# Altium schematic sheet Microcontroller.SchDoc
size 558 x 431 mm; SheetNumber: 2; SheetTotal: 4
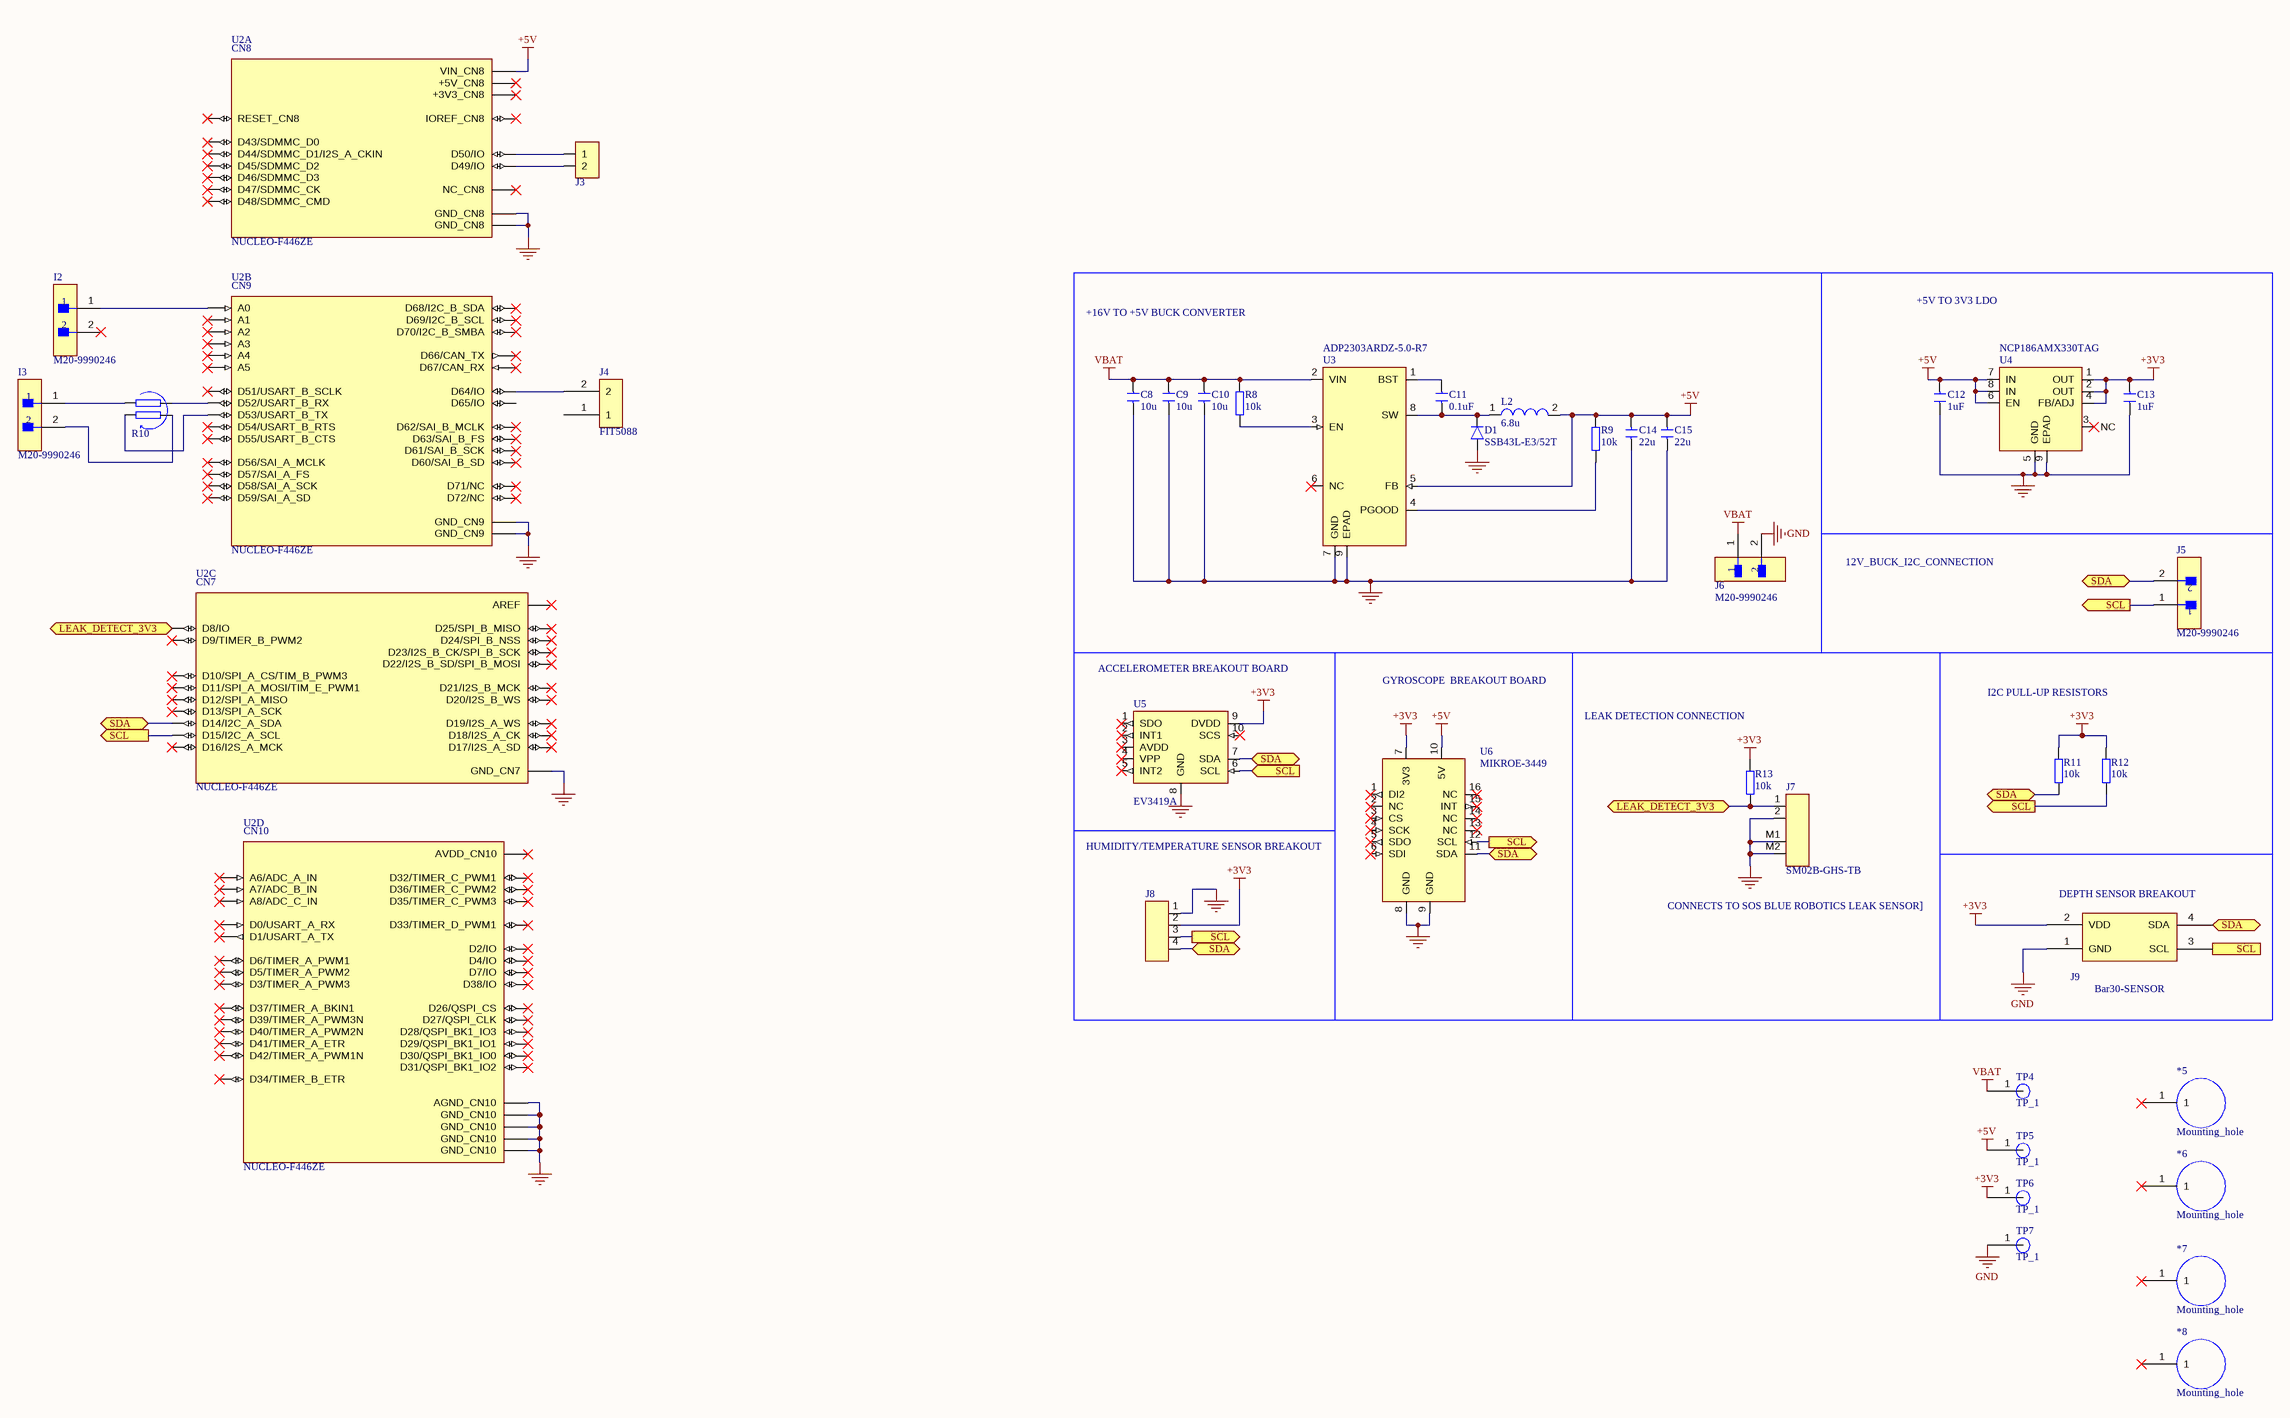
[diagram p0: Microcontroller.SchDoc]

## Parts
*5  Mounting_hole  [Mounting_Hole]
*6  Mounting_hole  [Mounting_Hole]
*7  Mounting_hole  [Mounting_Hole]
*8  Mounting_hole  [Mounting_Hole]
C8  10u  [1206 Capacitor]
C9  10u  [1206 Capacitor]
C10  10u  [1206 Capacitor]
C11  0.1uF  [0603 Capacitor]
C12  1uF  [0603 Capacitor]
C13  1uF  [0603 Capacitor]
C14  22u  [0805 Capacitor]
C15  22u  [0805 Capacitor]
D1  SSB43L-E3/52T  [DO-214AA]
I2  M20-9990246  [FP-M20-9990246-MFG]
I3  M20-9990246  [FP-M20-9990246-MFG]
J3  PREC002SAAN-RC  [Header 2.54mm]  (value not drawn)
J4  FIT5088  [FIT0588]
J5  M20-9990246  [FP-M20-9990246-MFG]
J6  M20-9990246  [FP-M20-9990246-MFG]
J7  SM02B-GHS-TB  [SM02B-GHS-TB]
J8  PPTC041LFBN-RC  [HDR 4POS 2.54mm]  (value not drawn)
J9  Bar30-SENSOR  [Bar30 Depth Sensor]
L2  6.8u  [CLF10060NIT-6R8N-D 10.10mm x 10.00mm]
R8  10k  [0603 Resistor]
R9  10k  [0603 Resistor]
R10  Resistor Signal Switch  [Resistor Signal Switch-Footprint]  (value not drawn)
R11  10k  [0603 Resistor]
R12  10k  [0603 Resistor]
R13  10k  [0603 Resistor]
TP4  TP_1  [Test_point1]  (no BOM)
TP5  TP_1  [Test_point1]  (no BOM)
TP6  TP_1  [Test_point1]  (no BOM)
TP7  TP_1  [Test_point1]  (no BOM)
U2  NUCLEO-F446ZE  [MODULE_NUCLEO-F446ZE]  (parts A,B,C,D of 4)
U3  ADP2303ARDZ-5.0-R7  [SOIC-8-EP]
U4  NCP186AMX330TAG  [8-XFDFN Exposed Pad]
U5  EV3419A  [EV3419A]
U6  MIKROE-3449  [MIKROE-3449]

## Ports
LEAK_DETECT_3V3 (bidir, see Microcontroller[3E]), LEAK_DETECT_3V3 (bidir, see Microcontroller[9E]), SCL (in, see Microcontroller[1D], Microcontroller[2E], Microcontroller[4D], Microcontroller[5D], Microcontroller[9E]), SCL (out, see Microcontroller[1D], Microcontroller[2E], Microcontroller[4D], Microcontroller[5D], Microcontroller[5E]), SCL (out, see Microcontroller[1D], Microcontroller[2E], Microcontroller[4D], Microcontroller[5D], Microcontroller[5E], Microcontroller[9E]), SCL (out, see Microcontroller[1D], Microcontroller[2E], Microcontroller[4D], Microcontroller[5E], Microcontroller[9E]), SCL (out, see Microcontroller[1D], Microcontroller[2E], Microcontroller[5D], Microcontroller[5E], Microcontroller[9E]), SCL (out, see Microcontroller[2E], Microcontroller[4D], Microcontroller[5D], Microcontroller[5E], Microcontroller[9E]), SDA (bidir, see Microcontroller[1D], Microcontroller[2E], Microcontroller[4D], Microcontroller[5D], Microcontroller[5E]), SDA (bidir, see Microcontroller[1D], Microcontroller[2E], Microcontroller[4D], Microcontroller[5D], Microcontroller[5E], Microcontroller[9E]), SDA (bidir, see Microcontroller[1D], Microcontroller[2E], Microcontroller[4D], Microcontroller[5D], Microcontroller[9E]), SDA (bidir, see Microcontroller[1D], Microcontroller[2E], Microcontroller[4D], Microcontroller[5E], Microcontroller[9E]), SDA (bidir, see Microcontroller[1D], Microcontroller[2E], Microcontroller[5D], Microcontroller[5E], Microcontroller[9E]), SDA (bidir, see Microcontroller[2E], Microcontroller[4D], Microcontroller[5D], Microcontroller[5E], Microcontroller[9E])

## Nets
+3V3: C13.1 J8.2 J9.2(VDD) R11.2 R12.2 R13.2 TP6.1 U4.1(OUT) U4.2(OUT) U4.4(FB/ADJ) U5.9(DVDD) U6.7(3V3)
+5V: C12.1 C14.1 C15.1 L2.2 R9.1 TP5.1 U2.CN8_15(VIN_CN8) U3.5(FB) U4.6(EN) U4.7(IN) U4.8(IN) U6.10(5V)
GND: C8.1 C9.1 C10.1 C12.2 C13.2 C14.2 C15.2 D1.A J6.2 J7.2 J7.M1 J7.M2 J8.1 J9.1(GND) TP7.1 U2.CN7_8(GND_CN7) U2.CN8_11(GND_CN8) U2.CN8_13(GND_CN8) U2.CN9_12(GND_CN9) U2.CN9_23(GND_CN9) U2.CN10_3(AGND_CN10) U2.CN10_5(GND_CN10) U2.CN10_17(GND_CN10) U2.CN10_22(GND_CN10) U2.CN10_27(GND_CN10) U3.7(GND) U3.9(EPAD) U4.5(GND) U4.9(EPAD) U5.8(GND) U6.8(GND) U6.9(GND)
VBAT: C8.2 C9.2 C10.2 J6.1 R8.1 TP4.1 U3.2(VIN)
LEAK_DETECT_3V3: J7.1 R13.1 U2.CN7_20(D8/IO) ; port LEAK_DETECT_3V3
SCL: J5.1 J8.3 J9.3(SCL) R12.1 U2.CN7_2(D15/I2C_A_SCL) U5.6(SCL) U6.12(SCL) ; port SCL
SDA: J5.2 J8.4 J9.4(SDA) R11.1 U2.CN7_4(D14/I2C_A_SDA) U5.7(SDA) U6.11(SDA) ; port SDA
NetC11_1: C11.1 D1.C L2.1 U3.8(SW)
NetC11_2: C11.2 U3.1(BST)
NetI2_1: I2.1 U2.CN9_1(A0)
NetI3_1: I3.1 R10.4
NetI3_2: I3.2 R10.1
NetJ3_1: J3.1 U2.CN8_16(D50/IO)
NetJ3_2: J3.2 U2.CN8_14(D49/IO)
NetJ4_2: J4.2 U2.CN9_30(D64/IO)
NetR8_2: R8.2 U3.3(EN)
NetR9_2: R9.2 U3.4(PGOOD)
NetR10_2: R10.2 U2.CN9_6(D53/USART_B_TX)
NetR10_3: R10.3 U2.CN9_4(D52/USART_B_RX)

Not connected (* = marked no-connect by the designer): *5 1*; *6 1*; *7 1*; *8 1*; I2 2*; J4 1; U2 CN7_1(D16/I2S_A_MCK)* CN7_3(D17/I2S_A_SD)* CN7_5(D18/I2S_A_CK)* CN7_6(AREF)* CN7_7(D19/I2S_A_WS)* CN7_9(D20/I2S_B_WS)* CN7_10(D13/SPI_A_SCK)* CN7_11(D21/I2S_B_MCK)* CN7_12(D12/SPI_A_MISO)* CN7_13(D22/I2S_B_SD/SPI_B_MOSI)* CN7_14(D11/SPI_A_MOSI/TIM_E_PWM1)* CN7_15(D23/I2S_B_CK/SPI_B_SCK)* CN7_16(D10/SPI_A_CS/TIM_B_PWM3)* CN7_17(D24/SPI_B_NSS)* CN7_18(D9/TIMER_B_PWM2)* CN7_19(D25/SPI_B_MISO)* CN8_1(NC_CN8)* CN8_2(D43/SDMMC_D0)* CN8_3(IOREF_CN8)* CN8_4(D44/SDMMC_D1/I2S_A_CKIN)* CN8_5(RESET_CN8)* CN8_6(D45/SDMMC_D2)* CN8_7(+3V3_CN8)* CN8_8(D46/SDMMC_D3)* CN8_9(+5V_CN8)* CN8_10(D47/SDMMC_CK)* CN8_12(D48/SDMMC_CMD)* CN9_2(D51/USART_B_SCLK)* CN9_3(A1)* CN9_5(A2)* CN9_7(A3)* CN9_8(D54/USART_B_RTS)* CN9_9(A4)* CN9_10(D55/USART_B_CTS)* CN9_11(A5)* CN9_13(D72/NC)* CN9_14(D56/SAI_A_MCLK)* CN9_15(D71/NC)* CN9_16(D57/SAI_A_FS)* CN9_17(D70/I2C_B_SMBA)* CN9_18(D58/SAI_A_SCK)* CN9_19(D69/I2C_B_SCL)* CN9_20(D59/SAI_A_SD)* CN9_21(D68/I2C_B_SDA)* CN9_22(D60/SAI_B_SD)* CN9_24(D61/SAI_B_SCK)* CN9_25(D67/CAN_RX)* CN9_26(D62/SAI_B_MCLK)* CN9_27(D66/CAN_TX)* CN9_28(D63/SAI_B_FS)* CN9_29(D65/IO) CN10_1(AVDD_CN10)* CN10_2(D7/IO)* CN10_4(D6/TIMER_A_PWM1)* CN10_6(D5/TIMER_A_PWM2)* CN10_7(A6/ADC_A_IN)* CN10_8(D4/IO)* CN10_9(A7/ADC_B_IN)* CN10_10(D3/TIMER_A_PWM3)* CN10_11(A8/ADC_C_IN)* CN10_12(D2/IO)* CN10_13(D26/QSPI_CS)* CN10_14(D1/USART_A_TX)* CN10_15(D27/QSPI_CLK)* CN10_16(D0/USART_A_RX)* CN10_18(D42/TIMER_A_PWM1N)* CN10_19(D28/QSPI_BK1_IO3)* CN10_20(D41/TIMER_A_ETR)* CN10_21(D29/QSPI_BK1_IO1)* CN10_23(D30/QSPI_BK1_IO0)* CN10_24(D40/TIMER_A_PWM2N)* CN10_25(D31/QSPI_BK1_IO2)* CN10_26(D39/TIMER_A_PWM3N)* CN10_28(D38/IO)* CN10_29(D32/TIMER_C_PWM1)* CN10_30(D37/TIMER_A_BKIN1)* CN10_31(D33/TIMER_D_PWM1)* CN10_32(D36/TIMER_C_PWM2)* CN10_33(D34/TIMER_B_ETR)* CN10_34(D35/TIMER_C_PWM3)*; U3 6(NC)*; U4 3(NC); U5 1(SDO)* 2(INT1)* 3(AVDD)* 4(VPP)* 5(INT2)* 10(SCS)*; U6 1(DI2)* 2(NC)* 3(CS)* 4(SCK)* 5(SDO)* 6(SDI)* 13(NC)* 14(NC)* 15(INT)* 16(NC)*

## Notes on the sheet
- +16V TO +5V BUCK CONVERTER
- +5V TO 3V3 LDO
- 12V_BUCK_I2C_CONNECTION
- ACCELEROMETER BREAKOUT BOARD
- GYROSCOPE  BREAKOUT BOARD
- LEAK DETECTION CONNECTION
- I2C PULL-UP RESISTORS
- HUMIDITY/TEMPERATURE SENSOR BREAKOUT
- CONNECTS TO SOS BLUE ROBOTICS LEAK SENSOR]
- (near J9) DEPTH SENSOR BREAKOUT
- DWG. NO.
- REV.
- SHT.
- REVISION
- DESCRIPTION
- DATE
- APPROVED
- THIS DOCUMENT AND THE DATA DISCLOSED HEREIN OR HEREWITH IS THE PROPERTY OF ALTIUM LIMITED AND MAY BE FREELY DISTRIBUTED IN WHOLE. NO RIGHTS ARE RESERVED OR EXPRESS OR IMPLIED WARANTEE GIVEN.
- ENG:
- DSN:
- APPROVALS
- PROJECT
- DOCUMENT REVISION:
- DESIGN ITEM:
- CHK:
- BOM:
- REFERENCE DOCUMENTS
- PROJECT REVISION:
- TITLE
- FAB DWG:
- PCB DWG:
- ASSY DWG:
- SCALE:
- SIZE
- C
- CAGE CODE
- FILE NAME
- DWG NO.
- SHEET
- OF
- REV
- (in symbol CMP-357-000000-6, part A) CN8
- (in symbol CMP-357-000000-6, part B) CN9
- (in symbol CMP-357-000000-6, part C) CN7
- (in symbol CMP-357-000000-6, part D) CN10

## Library data of the parts
C8-C10 = GRM31CR71E106MA12L: CAP CER 10UF 25V X7R 1206; Manufacturer: Murata; Material: 4241ConductorMaterial; Tolerance: 20%; Supplier: Digi-Key; Supplier Part Number: 490-6519-1-ND; Manufacturer Part Number: GRM31CR71E106MA12L; RoHS: Yes; Category: Ceramic Capacitors; Stock: 74067; Pricing: 1=0.29, 10=0.199, 50=0.1396, 100=0.1196, 500=0.08972, 1000=0.07576 (USD); Mounting Technology: Surface Mount; Case/Package: 1206; Case Code (Metric): 3216; Case Code (Imperial): 1206; Min Operating Temperature: -55°C; Max Operating Temperature: 125°C; Value: 10uF; Dielectric: X7R; Package Quantity: 1; Voltage Rating: 25V; Packaging: Tape and Reel; Termination: SMD/SMT; Voltage: 25V; Voltage Rating (DC): 25V; Series: GRM; Construction: Flat; Length: 3.2mm; Width: 0.063inch; Height: 1.6mm; Thickness: 0.071inch; Depth: 1.6mm; Radiation Hardening: No; Reach SVHC Compliant: No; Lead Free: Lead Free; RoHS Compliant: Yes; ComponentLink1URL: https://datasheet.ciiva.com/11607/product-11607561.pdf?src-supplier=Avnet; ComponentLink1Description: https://datasheet.ciiva.com/11607/product-11607561.pdf?src-supplier=Avnet; ComponentLink2URL: https://datasheet.ciiva.com/5412/product-5412861.pdf?src-supplier=Mouser; ComponentLink2Description: https://datasheet.ciiva.com/5412/product-5412861.pdf?src-supplier=Mouser; ComponentLink3URL: https://datasheet.ciiva.com/6264/partnumbering-e-01-6264463.pdf?src-supplier=Digi-Key; ComponentLink3Description: https://datasheet.ciiva.com/6264/partnumbering-e-01-6264463.pdf?src-supplier=Digi-Key
C11 = CC0603KRX7R9BB104: CAP CER 0.1UF 50V X7R 0603; Manufacturer: Yageo; Dielectric Material: Ceramic; Value: 100nF; Tolerance: 10%; Supplier: Digi-Key; Supplier Part Number: 311-1344-1-ND; Manufacturer Part Number: CC0603KRX7R9BB104; RoHS: Yes; Category: Ceramic Capacitors; Stock: 4893723; Pricing: 1=0.1, 10=0.054, 50=0.0296, 100=0.0243, 500=0.01732, 1000=0.01361 (USD); Mounting Technology: Surface Mount; Case/Package: 0603; Pins: 2; Case Code (Metric): 1608; Case Code (Imperial): 0603; Min Operating Temperature: -55°C; Max Operating Temperature: 125°C; Package Quantity: 1; Voltage Rating: 50V; Packaging: Tape and Reel; Dielectric: X7R; Termination: SMD/SMT; Voltage: 50V; Series: CC; Length: 0.063inch; Width: 0.031inch; Height: 0.8mm; Thickness: 0.035inch; Depth: 0.8mm; Radiation Hardening: No; Reach SVHC Compliant: No; Lead Free: Lead Free; Halogen Free: Halogen Free; RoHS Compliant: Yes; ComponentLink1URL: https://datasheet.ciiva.com/11786/0900766b80d84f1d-11786061.pdf?src-supplier=Rs; ComponentLink1Description: https://datasheet.ciiva.com/11786/0900766b80d84f1d-11786061.pdf?src-supplier=Rs; ComponentLink2URL: https://datasheet.ciiva.com/8033/70765-8033819.pdf?src-supplier=Element14; ComponentLink2Description: https://datasheet.ciiva.com/8033/70765-8033819.pdf?src-supplier=Element14; ComponentLink3URL: https://datasheet.ciiva.com/8033/70765-8033821.pdf?src-supplier=Element14; ComponentLink3Description: https://datasheet.ciiva.com/8033/70765-8033821.pdf?src-supplier=Element14; ComponentLink4URL: https://datasheet.ciiva.com/7978/1489800-7978166.pdf?src-supplier=Element14; ComponentLink4Description: https://datasheet.ciiva.com/7978/1489800-7978166.pdf?src-supplier=Element14; ComponentLink5URL: https://datasheet.ciiva.com/31394/1489800-31394927.pdf?src-supplier=Farnell; ComponentLink5Description: https://datasheet.ciiva.com/31394/1489800-31394927.pdf?src-supplier=Farnell; ComponentLink6URL: https://datasheet.ciiva.com/22749/1489800-22749214.pdf?src-supplier=Element14; ComponentLink6Description: https://datasheet.ciiva.com/22749/1489800-22749214.pdf?src-supplier=Element14; ComponentLink7URL: https://datasheet.ciiva.com/144/mlccorderingcode-144177.pdf?src-supplier=Digi-Key; ComponentLink7Description: https://datasheet.ciiva.com/144/mlccorderingcode-144177.pdf?src-supplier=Digi-Key; ComponentLink8URL: https://datasheet.ciiva.com/144/mlccorderingcode-144176.pdf?src-supplier=Digi-Key; ComponentLink8Description: https://datasheet.ciiva.com/144/mlccorderingcode-144176.pdf?src-supplier=Digi-Key; ComponentLink9URL: https://datasheet.ciiva.com/144/mlccorderingcode-144178.pdf?src-supplier=Digi-Key; ComponentLink9Description: https://datasheet.ciiva.com/144/mlccorderingcode-144178.pdf?src-supplier=Digi-Key
C12 C13 = CL10A105KB8NNNC: CAP CER 1UF 50V X5R 0603; Manufacturer: Samsung; Tolerance: 10%; Supplier: Digi-Key; Supplier Part Number: 1276-1860-1-ND; Manufacturer Part Number: CL10A105KB8NNNC; RoHS: Yes; Category: Ceramic Capacitors; Stock: 3695273; Pricing: 1=0.14, 10=0.098, 50=0.0558, 100=0.0462, 500=0.03238, 1000=0.0268 (USD); Mounting Technology: Surface Mount; Case/Package: 0603; Case Code (Metric): 1608; Case Code (Imperial): 0603; Min Operating Temperature: -55°C; Max Operating Temperature: 85°C; Packaging: Tape and Reel; Value: 1uF; Voltage Rating: 50V; Dielectric: X5R; Series: CL; Length: 1.6mm; Depth: 0.8mm; Radiation Hardening: No; RoHS Compliant: Yes; ComponentLink1URL: https://datasheet.ciiva.com/26877/getdatasheetpartid-753736-26877879.pdf?src-supplier=Verical; ComponentLink1Description: https://datasheet.ciiva.com/26877/getdatasheetpartid-753736-26877879.pdf?src-supplier=Verical
C14 C15 = GRM21BZ71A226ME15L: CAP CER 22UF 10V X7R 0805; Manufacturer: Murata; Supplier: Digi-Key; Supplier Part Number: 490-GRM21BZ71A226ME15LCT-ND; Manufacturer Part Number: GRM21BZ71A226ME15L; RoHS: Yes; Category: Ceramic Capacitors; Stock: 55376; Pricing: 1=0.35, 10=0.241, 50=0.1688, 100=0.1447, 500=0.10852, 1000=0.09164 (USD); RoHS Compliant: Yes; ComponentLink1URL: https://datasheet.octopart.com/GRM21BZ71A226ME15L-Murata-datasheet-165579666.pdf?src-supplier=TME; ComponentLink1Description: https://datasheet.octopart.com/GRM21BZ71A226ME15L-Murata-datasheet-165579666.pdf?src-supplier=TME
D1 = SSB43L-E3/52T: DIODE SCHOTTKY 30V 4A DO214AA; Manufacturer: Vishay Semiconductors; Max Surge Current: 100A; Forward Voltage: 450mV; Max Reverse Current: 600uA; Polarity: Standard; Supplier: Digi-Key; Supplier Part Number: SSB43L-E3/52TGICT-ND; Manufacturer Part Number: SSB43L-E3/52T; RoHS: Yes; Category: Rectifier Diodes; Stock: 42896; Pricing: 1=0.56, 10=0.482, 100=0.3351 (USD); Mounting Technology: Surface Mount; Case/Package: DO-214AA; Pins: 2; Min Operating Temperature: -65°C; Max Operating Temperature: 150°C; Packaging: Tape and Reel; Forward Current: 4A; Package Quantity: 1; Max Reverse Leakage Current: 600uA; Average Rectified Current: 4A; Peak Non-Repetitive Surge Current: 100A; Max Repetitive Reverse Voltage (Vrrm): 30V; Max Forward Surge Current (Ifsm): 100A; Voltage Rating (DC): 30V; Current Rating: 4A; Output Current: 4A; Max Reverse Voltage (DC): 30V; Length: 4.7mm; Width: 3.8mm; Height: 0.095inch; Radiation Hardening: No; Lead Free: Lead Free; RoHS Compliant: Yes; Reach SVHC Compliant: Unknown; ComponentLink1URL: https://datasheet.ciiva.com/14634/0900766b80dd0508-14634162.pdf?src-supplier=Allied+Electronics; ComponentLink1Description: https://datasheet.ciiva.com/14634/0900766b80dd0508-14634162.pdf?src-supplier=Allied+Electronics; ComponentLink2URL: https://datasheet.ciiva.com/4245/ssb43l-4245635.pdf?src-supplier=Arrow+Electronics; ComponentLink2Description: https://datasheet.ciiva.com/4245/ssb43l-4245635.pdf?src-supplier=Arrow+Electronics; ComponentLink3URL: https://datasheet.ciiva.com/18434/70217334-18434422.pdf?src-supplier=Allied+Electronics; ComponentLink3Description: https://datasheet.ciiva.com/18434/70217334-18434422.pdf?src-supplier=Allied+Electronics
I2 I3 J5 J6 = CMP-15831-000009-1: CONN HEADER VERT 2POS 2.54MM; Manufacturer: Harwin; Conn Gender: Male; Conn Orientation: Vertical; Number Of Contacts: 2; Current Rating: 3A; ComponentLink2URL: https://cdn.harwin.com/pdfs/M20-999.pdf; ComponentLink2Description: Datasheet; Package: M20-9990246; Temperature: -40°C to +105°C; Octopart: https://octopart.com/m20-9990246-harwin-2590635; Mouser Description: 2.54mm (0.1") Pitch SIL Vertical PC Tail Pin Header, 6.1mm mating pin height, tin, 2 contacts; Temperature Range High: +105°C; Device Class L1: Connectors; RoHS: TRUE; Automotive: No; Height: 8.99mm; Number Of Rows: 1; Contact Material: Tin,Nickel; Category: Conn; Pitch: 2.54mm; Lead Free: Yes; Digikey Description: CONN HEADER VERT 2POS 2.54MM; Manufacturer Part Number: M20-9990246; Temperature Range Low: -40°C; Device Class L3: unset; Device Class L2: Headers and Wire Housings
J3 = PREC002SAAN-RC: CONN HEADER VERT 2POS 2.54MM; Manufacturer: Sullins; Number of Positions: 2; Pitch: 0.1inch; Supplier: Digi-Key; Supplier Part Number: S1012EC-02-ND; Manufacturer Part Number: PREC002SAAN-RC; RoHS: Yes; Category: Connectors; Stock: 23153; Pricing: 1=0.06, 10=0.056, 25=0.0416, 50=0.0356, 100=0.0345, 250=0.02972, 500=0.02852 (USD); Mounting Technology: Through Hole; Color: Black; Contact Plating: Tin; Package Quantity: 1; Number of Rows: 1; Packaging: Bulk; Termination: Solder; Series: -; Contact Type: Male Pin; Contact Mating Length: 0.23inch; RoHS Compliant: Yes; ComponentLink1URL: https://datasheet.ciiva.com/740/zrzczzzszzn-rc-st-11635-b-740843.pdf?src-supplier=Digi-Key; ComponentLink1Description: https://datasheet.ciiva.com/740/zrzczzzszzn-rc-st-11635-b-740843.pdf?src-supplier=Digi-Key
J7 = SM02B-GHS-TB: CONN HDR PIN; Manufacturer: JST; Supplier: Digikey; Supplier Part Number: 455-1564-1-ND; Manufacturer Part Number: SM02B-GHS-TB; RoHS: No; Stock: 9689; Pricing: 1=0.46, 10=0.39, 100=0.303, 500=0.2597, 1000=0.21642 (USD)
J8 = PPTC041LFBN-RC: CONN HDR 4POS 0.1 TIN PCB; Manufacturer: Sullins; Number of Positions: 4; Connector Type: Header; Voltage Rating: 250V; Pitch: 2.54mm; Supplier: Digikey; Supplier Part Number: S7002-ND; Manufacturer Part Number: PPTC041LFBN-RC; RoHS: Yes; Category: Connectors; Stock: 28323; Pricing: 1=0.46, 10=0.399, 100=0.3286, 500=0.28574, 1000=0.23574, 5000=0.20716, 10000=0.2041 (USD); Mounting Technology: Through Hole; Contact Material: Bronze; Housing Material: Plastic; Contact Finish - Mating: TIN; Insulation Color: Black; Insulation Material: Polyester; Contact Shape: Square; Min Operating Temperature: -40°C; Max Operating Temperature: 105°C; Number of Rows: 1; Packaging: Tray; Termination: Solder; Contact Type: Female Socket; Fastening Type: Pull; Series: -; Length: 10.7mm; Width: 2.5mm; Height: 8.5mm; Lead Free: Lead Free; RoHS Compliant: Yes; Flammability Rating: UL94 V-0; ComponentLink1URL: https://media.digikey.com/pdf/Data%20Sheets/Sullins%20PDFs/Female_Headers.100_DS.pdf?src-supplier=Digikey; ComponentLink1Description: https://media.digikey.com/pdf/Data%20Sheets/Sullins%20PDFs/Female_Headers.100_DS.pdf?src-supplier=Digikey; ComponentLink2URL: http://www.sullinscorp.com/catalogs/78_Page80-81_HEADER_.100_2.54mm_FEMALE.pdf?src-supplier=Future+Electronics; ComponentLink2Description: http://www.sullinscorp.com/catalogs/78_Page80-81_HEADER_.100_2.54mm_FEMALE.pdf?src-supplier=Future+Electronics; ComponentLink3URL: https://datasheet.octopart.com/PPTC041LFBN-RC-Sullins-datasheet-41308905.pdf?src-supplier=Future+Electronics; ComponentLink3Description: https://datasheet.octopart.com/PPTC041LFBN-RC-Sullins-datasheet-41308905.pdf?src-supplier=Future+Electronics
L2 = CLF10060NIT-6R8N-D: FIXED IND 6.8UH 4.25A 16.9 MOHM; Manufacturer: TDK; Core Material: Ferrite; RMS Current (Irms): 6.6A; DC Resistance (DCR): 16.9mR; Inductance Tolerance: 30%; Shielding: Shielded; Test Frequency: 100kHz; Supplier: Digi-Key; Supplier Part Number: 445-174715-1-ND; Manufacturer Part Number: CLF10060NIT-6R8N-D; RoHS: Yes; Category: Fixed Inductors; Stock: 2437; Pricing: 1=1.43, 10=1.323, 25=1.1024, 50=1.0364, 100=0.9261, 250=0.7938 (USD); Mounting Technology: Surface Mount; Case/Package: Nonstandard; Min Operating Temperature: -55°C; Max Operating Temperature: 150°C; Value: 6.8uH; Saturation Current: 4.25A; Packaging: Tape and Reel; Series: CLF-NI-D; Tolerance: 30%; Ratings: AEC-Q200; Reach SVHC Compliant: No; RoHS Compliant: Yes; ComponentLink1URL: https://product.tdk.com/info/en/catalog/datasheets/inductor_automotive_power_clf10060ni-d_en.pdf?src-supplier=Digi-Key; ComponentLink1Description: https://product.tdk.com/info/en/catalog/datasheets/inductor_automotive_power_clf10060ni-d_en.pdf?src-supplier=Digi-Key; ComponentLink2URL: https://product.tdk.com/info/en/catalog/datasheets/inductor_automotive_power_clf10060ni-d_en.pdf?ref_disty=digikey&src-supplier=Digi-Key; ComponentLink2Description: https://product.tdk.com/info/en/catalog/datasheets/inductor_automotive_power_clf10060ni-d_en.pdf?ref_disty=digikey&src-supplier=Digi-Key; ComponentLink3URL: http://www.farnell.com/datasheets/2159117.pdf?src-supplier=Element14; ComponentLink3Description: http://www.farnell.com/datasheets/2159117.pdf?src-supplier=Element14
R8 R9 R11-R13 = RC0603FR-1310KL: RES 10K OHM 1% 1/10W 0603; Manufacturer: Yageo; Value: 10kR; Power Rating: 100mW; Voltage Rating: 50V; Temperature Coefficient: 100ppm/°C; Supplier: Digi-Key; Supplier Part Number: 13-RC0603FR-1310KLDKR-ND; Manufacturer Part Number: RC0603FR-1310KL; RoHS: Yes; Category: Chip SMD Resistors; Stock: 124542; Pricing: 1=0.1, 10=0.018, 50=0.0106, 100=0.0088, 500=0.00592, 1000=0.00505, 5000=0.00363, 10000=0.00318 (USD); Pins: 2; Case Code (Imperial): 0603; Case Code (Metric): 1608; Case/Package: 0603; Min Operating Temperature: -55°C; Max Operating Temperature: 155°C; Tolerance: 1%; Packaging: Tape and Reel; Resistor Type: Thick Film; Termination: SMD/SMT; Voltage Rating (DC): 50V; Series: RC; Resistance Tolerance: 1%; RoHS Compliant: Yes; Reach SVHC Compliant: No; Lead Free: Lead Free; ComponentLink1URL: https://datasheet.ciiva.com/7983/443971-7983673.pdf?src-supplier=Element14; ComponentLink1Description: https://datasheet.ciiva.com/7983/443971-7983673.pdf?src-supplier=Element14; ComponentLink2URL: https://datasheet.ciiva.com/16850/pyu-rc0603-51-rohs-l-4-16850349.pdf?src-supplier=Future+Electronics; ComponentLink2Description: https://datasheet.ciiva.com/16850/pyu-rc0603-51-rohs-l-4-16850349.pdf?src-supplier=Future+Electronics
R10 = CMP-00078-2: Footprint for allowing switching of signal lines
TP4-TP7 = Test_point1
U2 = CMP-357-000000-6: STM32F446ZE, mbed-Enabled Development Nucleo-144 STM32F4 ARMÂ® CortexÂ®-M4 MCU 32-Bit Embedded Evaluation Board; MF: STMicroelectronics; Design Item ID: NUCLEO-F446ZE; Availability: In Stock; SnapEDA_Link: https://www.snapeda.com/parts/NUCLEO-F446ZE/STMicroelectronics/view-part/?ref=snap; MP: NUCLEO-F446ZE; Pin Count: 244; Component Type: Standard; Package: None; Source: NUCLEO-F446ZE.SchLib; Purchase-URL: https://pricing.snapeda.com/search/part/NUCLEO-F446ZE/?ref=eda; Price: None; Value: *; Check_prices: https://www.snapeda.com/parts/NUCLEO-F446ZE/STMicroelectronics/view-part/?ref=eda
U3 = ADP2303ARDZ-5.0-R7: IC REG BUCK 5V 3A 8SOIC; Manufacturer: Analog Devices; Number of Outputs: 1; Min Input Voltage: 3V; Max Supply Voltage: 20V; Rise Time: 170ns; Switching Frequency: 700kHz; Min Output Voltage: 800mV; Synchronous Rectifier: No; Operating Supply Current: 950uA; Fall Time: 280ns; Max Duty Cycle: 50%; Max Output Voltage: 16V; Output Type: Fixed; Output Configuration: Positive; Supplier: Digi-Key; Supplier Part Number: 505-ADP2303ARDZ-5.0-R7CT-ND; Manufacturer Part Number: ADP2303ARDZ-5.0-R7; RoHS: Yes; Category: Voltage Regulators - Switching; Stock: 1579; Pricing: 1=4.1, 10=3.678, 25=3.4768, 100=3.0133, 250=2.8588, 500=2.5652 (USD); Mounting Technology: Surface Mount; Case/Package: SOIC; Pins: 8; Weight: 0.019048oz; Contact Plating: Tin,Matte; Min Operating Temperature: -40°C; Max Operating Temperature: 125°C; Packaging: Tape and Reel; Output Current: 3A; Output Voltage: 5V; Operating Supply Voltage: 20V; Nominal Output Voltage: 5V; Max Output current: 3A; Series: -; Length: 4.9mm; Width: 4mm; Height: 1.75mm; Radiation Hardening: No; Reach SVHC Compliant: No; Lead Free: Contains Lead; RoHS Compliant: Yes; ComponentLink1URL: https://datasheet.ciiva.com/25626/0900766b810b59f9-25626508.pdf?src-supplier=Rs; ComponentLink1Description: https://datasheet.ciiva.com/25626/0900766b810b59f9-25626508.pdf?src-supplier=Rs; ComponentLink2URL: https://datasheet.ciiva.com/7994/1624274-7994911.pdf?src-supplier=Element14; ComponentLink2Description: https://datasheet.ciiva.com/7994/1624274-7994911.pdf?src-supplier=Element14; ComponentLink3URL: https://datasheet.ciiva.com/28436/1624274-28436554.pdf?src-supplier=Element14; ComponentLink3Description: https://datasheet.ciiva.com/28436/1624274-28436554.pdf?src-supplier=Element14; ComponentLink4URL: https://datasheet.ciiva.com/2024/adp2302-2303-2024382.pdf?src-supplier=Digi-Key; ComponentLink4Description: https://datasheet.ciiva.com/2024/adp2302-2303-2024382.pdf?src-supplier=Digi-Key; ComponentLink5URL: https://datasheet.ciiva.com/2024/adp2302-2303-2024383.pdf?src-supplier=Digi-Key; ComponentLink5Description: https://datasheet.ciiva.com/2024/adp2302-2303-2024383.pdf?src-supplier=Digi-Key; ComponentLink6URL: https://datasheet.ciiva.com/2024/adp2302-2303-2024384.pdf?src-supplier=Digi-Key; ComponentLink6Description: https://datasheet.ciiva.com/2024/adp2302-2303-2024384.pdf?src-supplier=Digi-Key; ComponentLink7URL: https://datasheet.ciiva.com/48696/001251161-da-01-en-ic-reg-buc-adp2303ardz-5-0-r7-soic-8-adi-48696838.pdf?src-supplier=Conrad; ComponentLink7Description: https://datasheet.ciiva.com/48696/001251161-da-01-en-ic-reg-buc-adp2303ardz-5-0-r7-soic-8-adi-48696838.pdf?src-supplier=Conrad
U4 = NCP186AMX330TAG: ICREGLDO3.3V1A8XDFN
U5 = EV3419A: MC3419 DAUGHTER CARD; Manufacturer: Memsic; Supplier: Digi-Key; Supplier Part Number: 3502-EV3419A-ND; Manufacturer Part Number: EV3419A; RoHS: No; Category: Uncategorized; Stock: 42; Pricing: 1=14.51 (USD)
U6 = MIKROE-3449: Gyro 3 Click I3G4250 Three-Axis Digital Gyroscope Sensor IC Add-On Board; Manufacturer: mikroElektronika; Supplier: Digi-Key; Supplier Part Number: 1471-2189-ND; Manufacturer Part Number: MIKROE-3449; RoHS: No; Stock: 1; Pricing: 1=25 (USD)